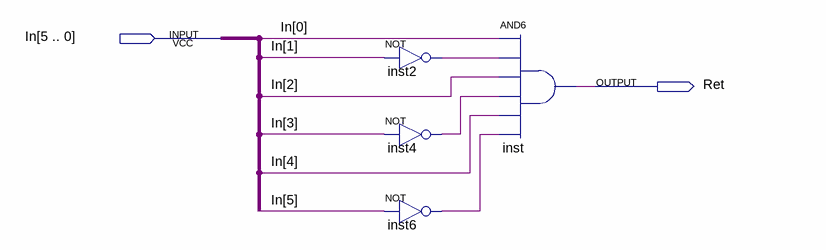
[diagram p0: schematic sheet]
// Quartus schematic On_4_Ret.bdf as structural Verilog: 4 symbols, 2 pins
module On_4_Ret (
  input  [5:0] In,
  output Ret
);

  wire inst2_out, inst4_out, inst6_out;

  not inst2 (inst2_out, In[1]);
  not inst4 (inst4_out, In[3]);
  not inst6 (inst6_out, In[5]);
  and inst (Ret, In[0], inst2_out, In[2], inst4_out, In[4], inst6_out);
endmodule
